# Altium schematic sheet Analog_input.SchDoc
size A; SheetNumber: 6; SheetTotal: 10
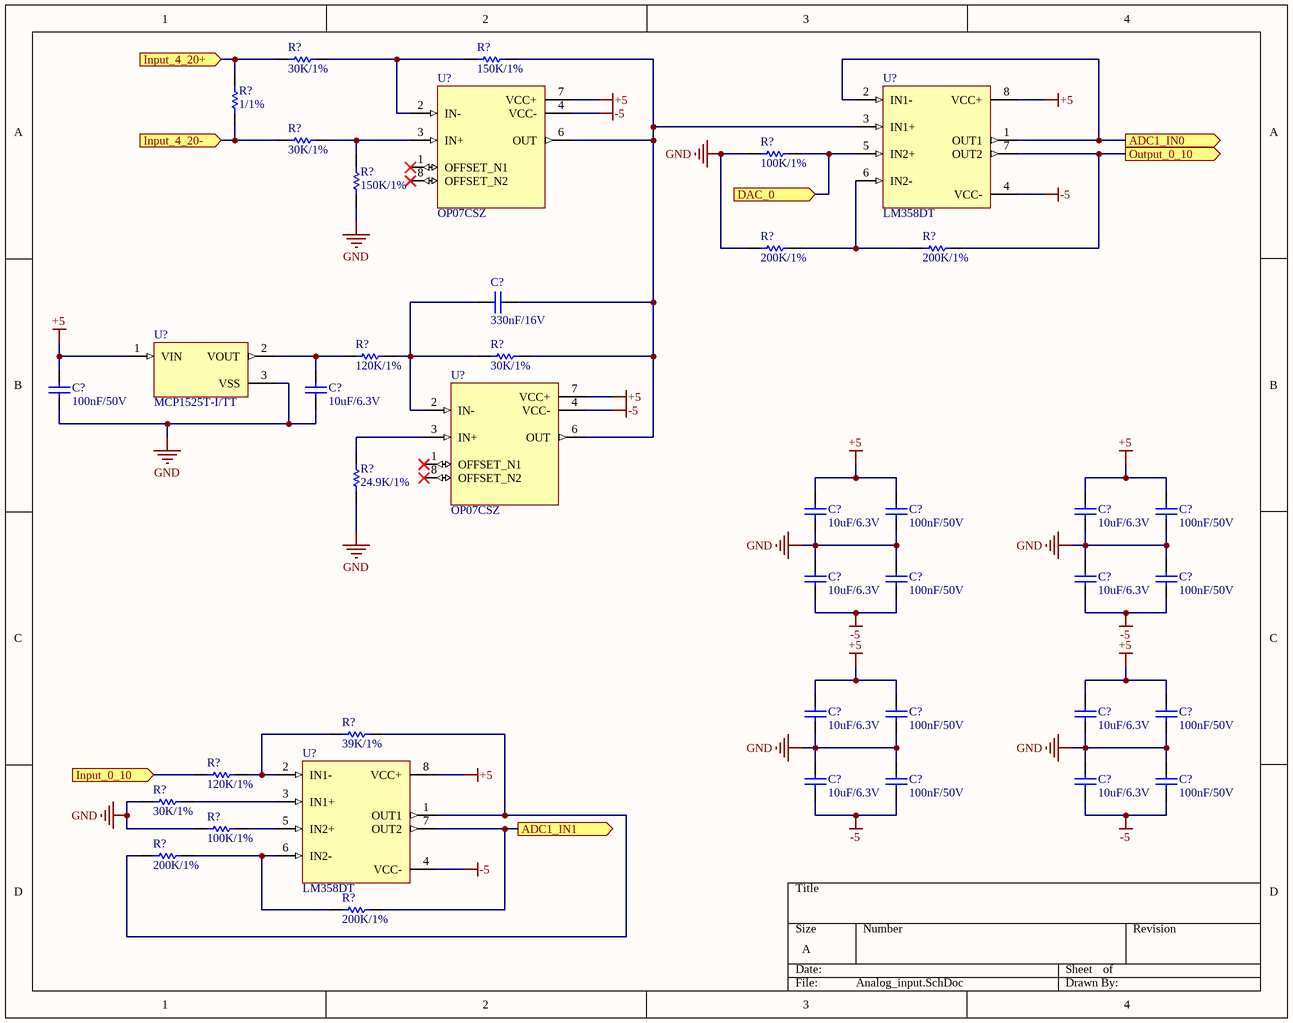
[diagram p0: Analog_input.SchDoc]

## Parts
(Parts that share a designator on the sheet are numbered #1, #2 ... from top to bottom, then left to right.)
C?#1  330nF/16V  [CAP_0805]
C?#2  100nF/50V  [CAP_0805]
C?#3  10uF/6.3V  [CAP_0805]
C?#4  10uF/6.3V  [CAP_0805]
C?#5  100nF/50V  [CAP_0805]
C?#6  10uF/6.3V  [CAP_0805]
C?#7  100nF/50V  [CAP_0805]
C?#8  10uF/6.3V  [CAP_0805]
C?#9  100nF/50V  [CAP_0805]
C?#10  10uF/6.3V  [CAP_0805]
C?#11  100nF/50V  [CAP_0805]
C?#12  10uF/6.3V  [CAP_0805]
C?#13  100nF/50V  [CAP_0805]
C?#14  10uF/6.3V  [CAP_0805]
C?#15  100nF/50V  [CAP_0805]
C?#16  10uF/6.3V  [CAP_0805]
C?#17  100nF/50V  [CAP_0805]
C?#18  10uF/6.3V  [CAP_0805]
C?#19  100nF/50V  [CAP_0805]
R?#1  30K/1%  [RES_0805]
R?#2  150K/1%  [RES_0805]
R?#3  1/1%  [RES_0805]
R?#4  30K/1%  [RES_0805]
R?#5  100K/1%  [RES_0805]
R?#6  150K/1%  [RES_0805]
R?#7  200K/1%  [RES_0805]
R?#8  200K/1%  [RES_0805]
R?#9  120K/1%  [RES_0805]
R?#10  30K/1%  [RES_0805]
R?#11  24.9K/1%  [RES_0805]
R?#12  39K/1%  [RES_0805]
R?#13  120K/1%  [RES_0805]
R?#14  30K/1%  [RES_0805]
R?#15  100K/1%  [RES_0805]
R?#16  200K/1%  [RES_0805]
R?#17  200K/1%  [RES_0805]
U?#1  OP07CSZ  [SOIC127P600X175-8N]
U?#2  LM358DT  [SOIC127P600X175-8N]
U?#3  MCP1525T-I/TT  [SOT95P237X112-3N]
U?#4  OP07CSZ  [SOIC127P600X175-8N]
U?#5  LM358DT  [SOIC127P600X175-8N]

## Ports
ADC1_IN0 (out), ADC1_IN1 (out), DAC_0 (in), Input_0_10 (in), Input_4_20+ (in), Input_4_20- (in), Output_0_10 (out)

## Nets
+5: C?#2.2 C?#4.2 C?#5.2 C?#6.2 C?#7.2 C?#12.2 C?#13.2 C?#14.2 C?#15.2 U?#1.7(VCC+) U?#2.8(VCC+) U?#3.1(VIN) U?#4.7(VCC+) U?#5.8(VCC+)
-5: C?#8.1 C?#9.1 C?#10.1 C?#11.1 C?#16.1 C?#17.1 C?#18.1 C?#19.1 U?#1.4(VCC-) U?#2.4(VCC-) U?#4.4(VCC-) U?#5.4(VCC-)
GND: C?#2.1 C?#3.1 C?#4.1 C?#5.1 C?#6.1 C?#7.1 C?#8.2 C?#9.2 C?#10.2 C?#11.2 C?#12.1 C?#13.1 C?#14.1 C?#15.1 C?#16.2 C?#17.2 C?#18.2 C?#19.2 R?#5.1 R?#6.1 R?#7.1 R?#11.1 R?#14.1 R?#15.1 U?#3.3(VSS)
ADC1_IN0: U?#2.1(OUT1) U?#2.2(IN1-) ; port ADC1_IN0
ADC1_IN1: R?#17.2 U?#5.7(OUT2) ; port ADC1_IN1
DAC_0: R?#5.2 U?#2.5(IN2+) ; port DAC_0
Input_0_10: R?#13.1 ; port Input_0_10
Input_4_20+: R?#1.1 R?#3.2 ; port Input_4_20+
Input_4_20-: R?#3.1 R?#4.1 ; port Input_4_20-
Output_0_10: R?#8.2 U?#2.7(OUT2) ; port Output_0_10
NetC?#1_1: C?#1.1 R?#2.2 R?#10.2 U?#1.6(OUT) U?#2.3(IN1+) U?#4.6(OUT)
NetC?#1_2: C?#1.2 R?#9.2 R?#10.1 U?#4.2(IN-)
NetC?#3_2: C?#3.2 R?#9.1 U?#3.2(VOUT)
NetR?#1_2: R?#1.2 R?#2.1 U?#1.2(IN-)
NetR?#4_2: R?#4.2 R?#6.2 U?#1.3(IN+)
NetR?#7_2: R?#7.2 R?#8.1 U?#2.6(IN2-)
NetR?#11_2: R?#11.2 U?#4.3(IN+)
NetR?#12_1: R?#12.1 R?#13.2 U?#5.2(IN1-)
NetR?#12_2: R?#12.2 R?#16.1 U?#5.1(OUT1)
NetR?#14_2: R?#14.2 U?#5.3(IN1+)
NetR?#15_2: R?#15.2 U?#5.5(IN2+)
NetR?#16_2: R?#16.2 R?#17.1 U?#5.6(IN2-)

Not connected (* = marked no-connect by the designer): U?#1 1(OFFSET_N1)* 8(OFFSET_N2)*; U?#4 1(OFFSET_N1)* 8(OFFSET_N2)*

## Library data of the parts
C?#1-C?#19 = Capacitor: Size: 0805
  C?#1: URL: https://www.thegioiic.com/tu-gom-0805-330nf-16v; Value: 330nF/16V
  C?#2 C?#5 C?#7 C?#9 C?#11 C?#13 C?#15 C?#17 C?#19: URL: https://www.thegioiic.com/tu-gom-0805-100nf-0-1uf-50v; Value: 100nF/50V
  C?#3 C?#4 C?#6 C?#8 C?#10 C?#12 C?#14 C?#16 C?#18: URL: https://www.thegioiic.com/tu-gom-0805-10uf-6-3v; Value: 10uF/6.3V
R?#1-R?#17 = Resistor: Size: 0805
  R?#1 R?#4 R?#10 R?#14: URL: https://www.thegioiic.com/dien-tro-30-kohm-0805-1-; Value: 30K/1%
  R?#2 R?#6: URL: https://www.thegioiic.com/dien-tro-150-kohm-0805-1-; Value: 150K/1%
  R?#3: URL: https://www.thegioiic.com/dien-tro-1-ohm-0805-1-https://www.thegioiic.com/dien-tro-1-ohm-0805-1-; Value: 1/1%
  R?#5 R?#15: URL: https://www.thegioiic.com/dien-tro-100-kohm-0805-1-; Value: 100K/1%
  R?#7 R?#8 R?#16 R?#17: URL: https://www.thegioiic.com/dien-tro-200-kohm-0805-1-; Value: 200K/1%
  R?#9 R?#13: URL: https://www.thegioiic.com/dien-tro-120-kohm-0805-1-; Value: 120K/1%
  R?#11: URL: https://www.thegioiic.com/dien-tro-24-9-kohm-0805-1-; Value: 24.9K/1%
  R?#12: URL: https://www.thegioiic.com/dien-tro-39-kohm-0805-1-; Value: 39K/1%
U?#1 U?#4 = OP07CSZ: Low-Offset Voltage Operational Amplifier; Size: 8-SOIC; URL: https://www.thegioiic.com/op07csz-ic-opamp-general-purpose-amplifier-1-circuit-600khz-8-soic; Value: OP07CSZ
U?#2 U?#5 = LM358DT: General Purpose Amplifier 2 Circuit 8-SO; Size: 8-SOIC; URL: https://www.thegioiic.com/lm358dt-ic-opamp-general-purpose-amplifier-2-circuit-1-1mhz-8-soic; Value: LM358DT
U?#3 = MCP1525T-I/TT: Series Voltage Reference IC Â±1% SOT-23-3; Value: 2.5VDC; Size: SOT-23; URL: https://www.thegioiic.com/mcp1525t-i-tt-ic-tham-chieu-dien-ap-2-5v-sot-23